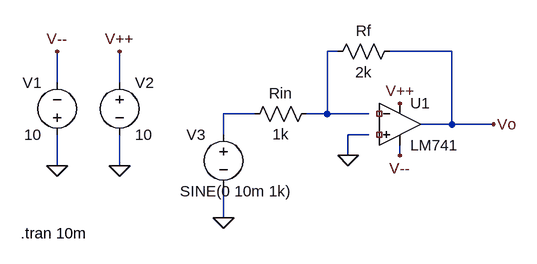
[diagram p0: schematic inv_amp.asc]
inv_amp.asc, the LTspice schematic file:
Version 4
SHEET 1 880 680
WIRE 80 32 64 32
WIRE 256 32 160 32
WIRE -352 80 -352 32
WIRE -256 80 -256 32
WIRE -48 128 -96 128
WIRE 64 128 64 32
WIRE 64 128 32 128
WIRE 128 128 64 128
WIRE 256 144 256 32
WIRE 256 144 208 144
WIRE 320 144 256 144
WIRE -96 160 -96 128
WIRE 128 160 96 160
WIRE 96 192 96 160
WIRE 176 192 176 176
WIRE -352 208 -352 160
WIRE -256 208 -256 160
WIRE -96 288 -96 240
FLAG -256 208 0
FLAG -352 208 0
FLAG -256 32 V++
FLAG -352 32 V--
FLAG 176 112 V++
FLAG 176 192 V--
FLAG 320 144 Vo
FLAG 96 192 0
FLAG -96 288 0
SYMBOL OpAmps\\LM741 176 80 R0
SYMATTR InstName U1
SYMBOL voltage -352 176 R180
WINDOW 0 24 96 Left 2
WINDOW 3 24 16 Left 2
WINDOW 123 0 0 Left 0
WINDOW 39 0 0 Left 0
SYMATTR InstName V1
SYMATTR Value 10
SYMBOL voltage -256 64 R0
WINDOW 123 0 0 Left 0
WINDOW 39 0 0 Left 0
SYMATTR InstName V2
SYMATTR Value 10
SYMBOL voltage -96 144 R0
WINDOW 0 -57 16 Left 2
WINDOW 3 -67 103 Left 2
WINDOW 123 0 0 Left 0
WINDOW 39 0 0 Left 0
SYMATTR InstName V3
SYMATTR Value SINE(0 10m 1k)
SYMBOL res 176 16 R90
WINDOW 0 0 56 VBottom 2
WINDOW 3 32 56 VTop 2
SYMATTR InstName Rf
SYMATTR Value 2k
SYMBOL res 48 112 R90
WINDOW 0 0 56 VBottom 2
WINDOW 3 32 56 VTop 2
SYMATTR InstName Rin
SYMATTR Value 1k
TEXT -408 312 Left 2 !.tran 10m

The netlist it stands for:
* inv_amp.asc
XU1 NC_01 NC_02 V++ V-- Vo LM741  ; pins In+ In- V+ V- OUT
V1 0 V-- 10
V2 V++ 0 10
V3 N002 0 SINE(0 10m 1k)
Rf Vo N001 2k
Rin N001 N002 1k
.tran 10m
.lib LM741.lib
.backanno
.end